# Altium schematic sheet top.SchDoc
size A4
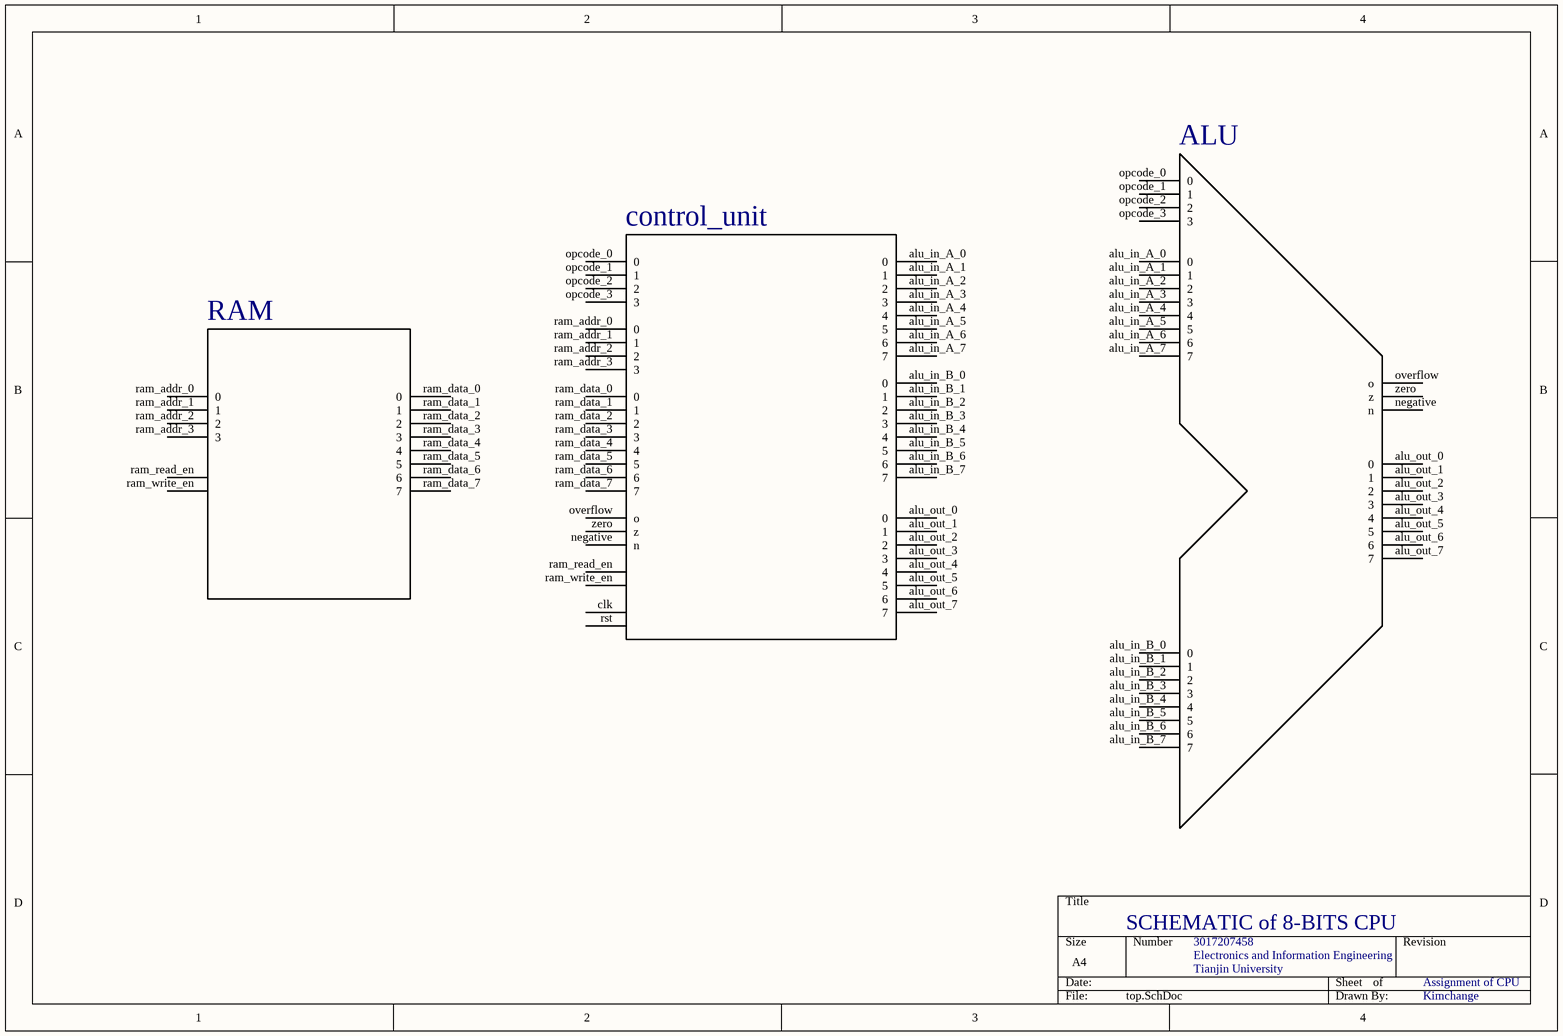
[diagram p0: top.SchDoc]

## Parts
ALU  opcode_0  (value not drawn)
control_unit  control_unit  (value not drawn)
RAM  0  (value not drawn)

## Nets

Not connected (* = marked no-connect by the designer): ALU alu_in_A_0(0) alu_in_A_1(1) alu_in_A_2(2) alu_in_A_3(3) alu_in_A_4(4) alu_in_A_5(5) alu_in_A_6(6) alu_in_A_7(7) alu_in_B_0(0) alu_in_B_1(1) alu_in_B_2(2) alu_in_B_3(3) alu_in_B_4(4) alu_in_B_5(5) alu_in_B_6(6) alu_in_B_7(7) alu_out_0(0) alu_out_1(1) alu_out_2(2) alu_out_3(3) alu_out_4(4) alu_out_5(5) alu_out_6(6) alu_out_7(7) negative(n) opcode_0(0) opcode_1(1) opcode_2(2) opcode_3(3) overflow(o) zero(z); control_unit alu_in_A_0(0) alu_in_A_1(1) alu_in_A_2(2) alu_in_A_3(3) alu_in_A_4(4) alu_in_A_5(5) alu_in_A_6(6) alu_in_A_7(7) alu_in_B_0(0) alu_in_B_1(1) alu_in_B_2(2) alu_in_B_3(3) alu_in_B_4(4) alu_in_B_5(5) alu_in_B_6(6) alu_in_B_7(7) alu_out_0(0) alu_out_1(1) alu_out_2(2) alu_out_3(3) alu_out_4(4) alu_out_5(5) alu_out_6(6) alu_out_7(7) clk negative(n) opcode_0(0) opcode_1(1) opcode_2(2) opcode_3(3) overflow(o) ram_addr_0(0) ram_addr_1(1) ram_addr_2(2) ram_addr_3(3) ram_data_0(0) ram_data_1(1) ram_data_2(2) ram_data_3(3) ram_data_4(4) ram_data_5(5) ram_data_6(6) ram_data_7(7) ram_read_en ram_write_en rst zero(z); RAM ram_addr_0(0) ram_addr_1(1) ram_addr_2(2) ram_addr_3(3) ram_data_0(0) ram_data_1(1) ram_data_2(2) ram_data_3(3) ram_data_4(4) ram_data_5(5) ram_data_6(6) ram_data_7(7) ram_read_en ram_write_en

## Notes on the sheet
- SCHEMATIC of 8-BITS CPU
- 3017207458
- Electronics and Information Engineering
- Tianjin University
- Assignment of CPU
- Kimchange

## Library data of the parts
ALU = Component_1
RAM = ram